# Altium schematic sheet 传感.SchDoc
size A4
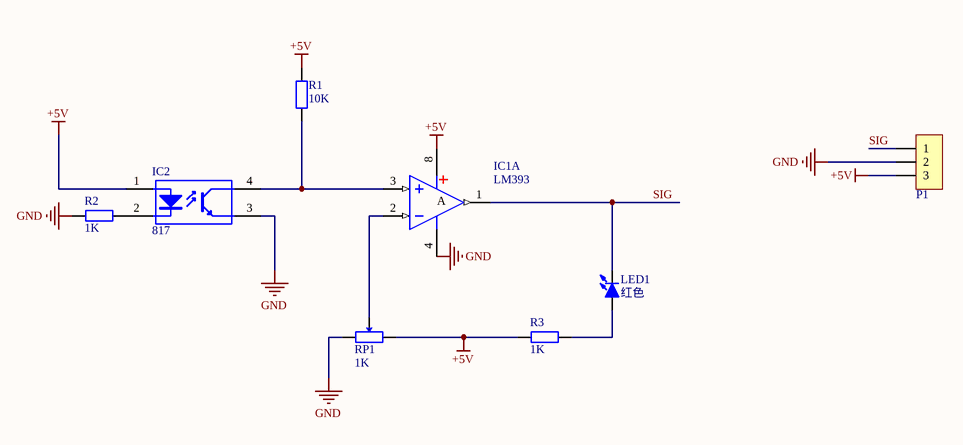
[diagram p0: 传感.SchDoc]

## Parts
IC1  LM393  [DIP8-300]  (part A of 2)
IC2  817  [DIP4-300]
LED1  红色  [LED 0805R]
P1  HDR-1X3  [KF301-5.0-3P]  (value not drawn)
R1  10K  [R 0805_L]
R2  1K  [R 0805_L]
R3  1K  [R 0805_L]
RP1  1K  [3296W]

## Nets
+5V: IC1.8(V+) IC2.1(A) P1.3 R1.2 R3.1 RP1.3
GND: IC1.4(V-) IC2.3(E) P1.2 R2.1 RP1.1
SIG: IC1.1(OUT) LED1.2(K) P1.1
NetIC1_2: IC1.2(IN-) RP1.2
NetIC1_3: IC1.3(IN+) IC2.4(C) R1.1
NetIC2_2: IC2.2(K) R2.2
NetLED1_1: LED1.1(A) R3.2

## Notes on the sheet
- (in symbol LM393, part A) A

## Library data of the parts
IC1 = LM393: 双路电压比较; 版权归属: 封装库来自淘宝 ID：黄晶宝石; BOM名称: 双路电压比较; 学习资源: https://shop463601444.taobao.com
IC2 = 817: 线性光耦; 版权归属: 封装库来自淘宝 ID：黄晶宝石; BOM名称: 线性光耦; 学习资源: https://shop463601444.taobao.com
LED1 = LED-SMD: 贴片LED; 版权归属: 封装库来自淘宝 ID：黄晶宝石; BOM名称: 贴片LED; 学习资源: https://shop463601444.taobao.com
P1 = Header 3: 3P接插件; 版权归属: 封装库来自淘宝 ID：黄晶宝石; BOM名称: 3P接插件; 学习资源: https://shop463601444.taobao.com
R1-R3 = R: 贴片电阻; 版权归属: 来自淘宝 ID：黄晶宝石; 封装库来自淘宝卖家 ID：黄晶宝石: 其他店铺购入均为盗版，不享受售后技术支持服务，请立即申请退款; BOM名称: 贴片电阻; 联系售后: https://shop463601444.taobao.com
RP1 = RP: 单联电位器; BOM名称: 插件电位器; 版权归属: 封装库来自淘宝 ID：黄晶宝石; 联系售后: https://shop463601444.taobao.com